# EAGLE schematic IRQF103C8 (EAGLE 7.6.0)
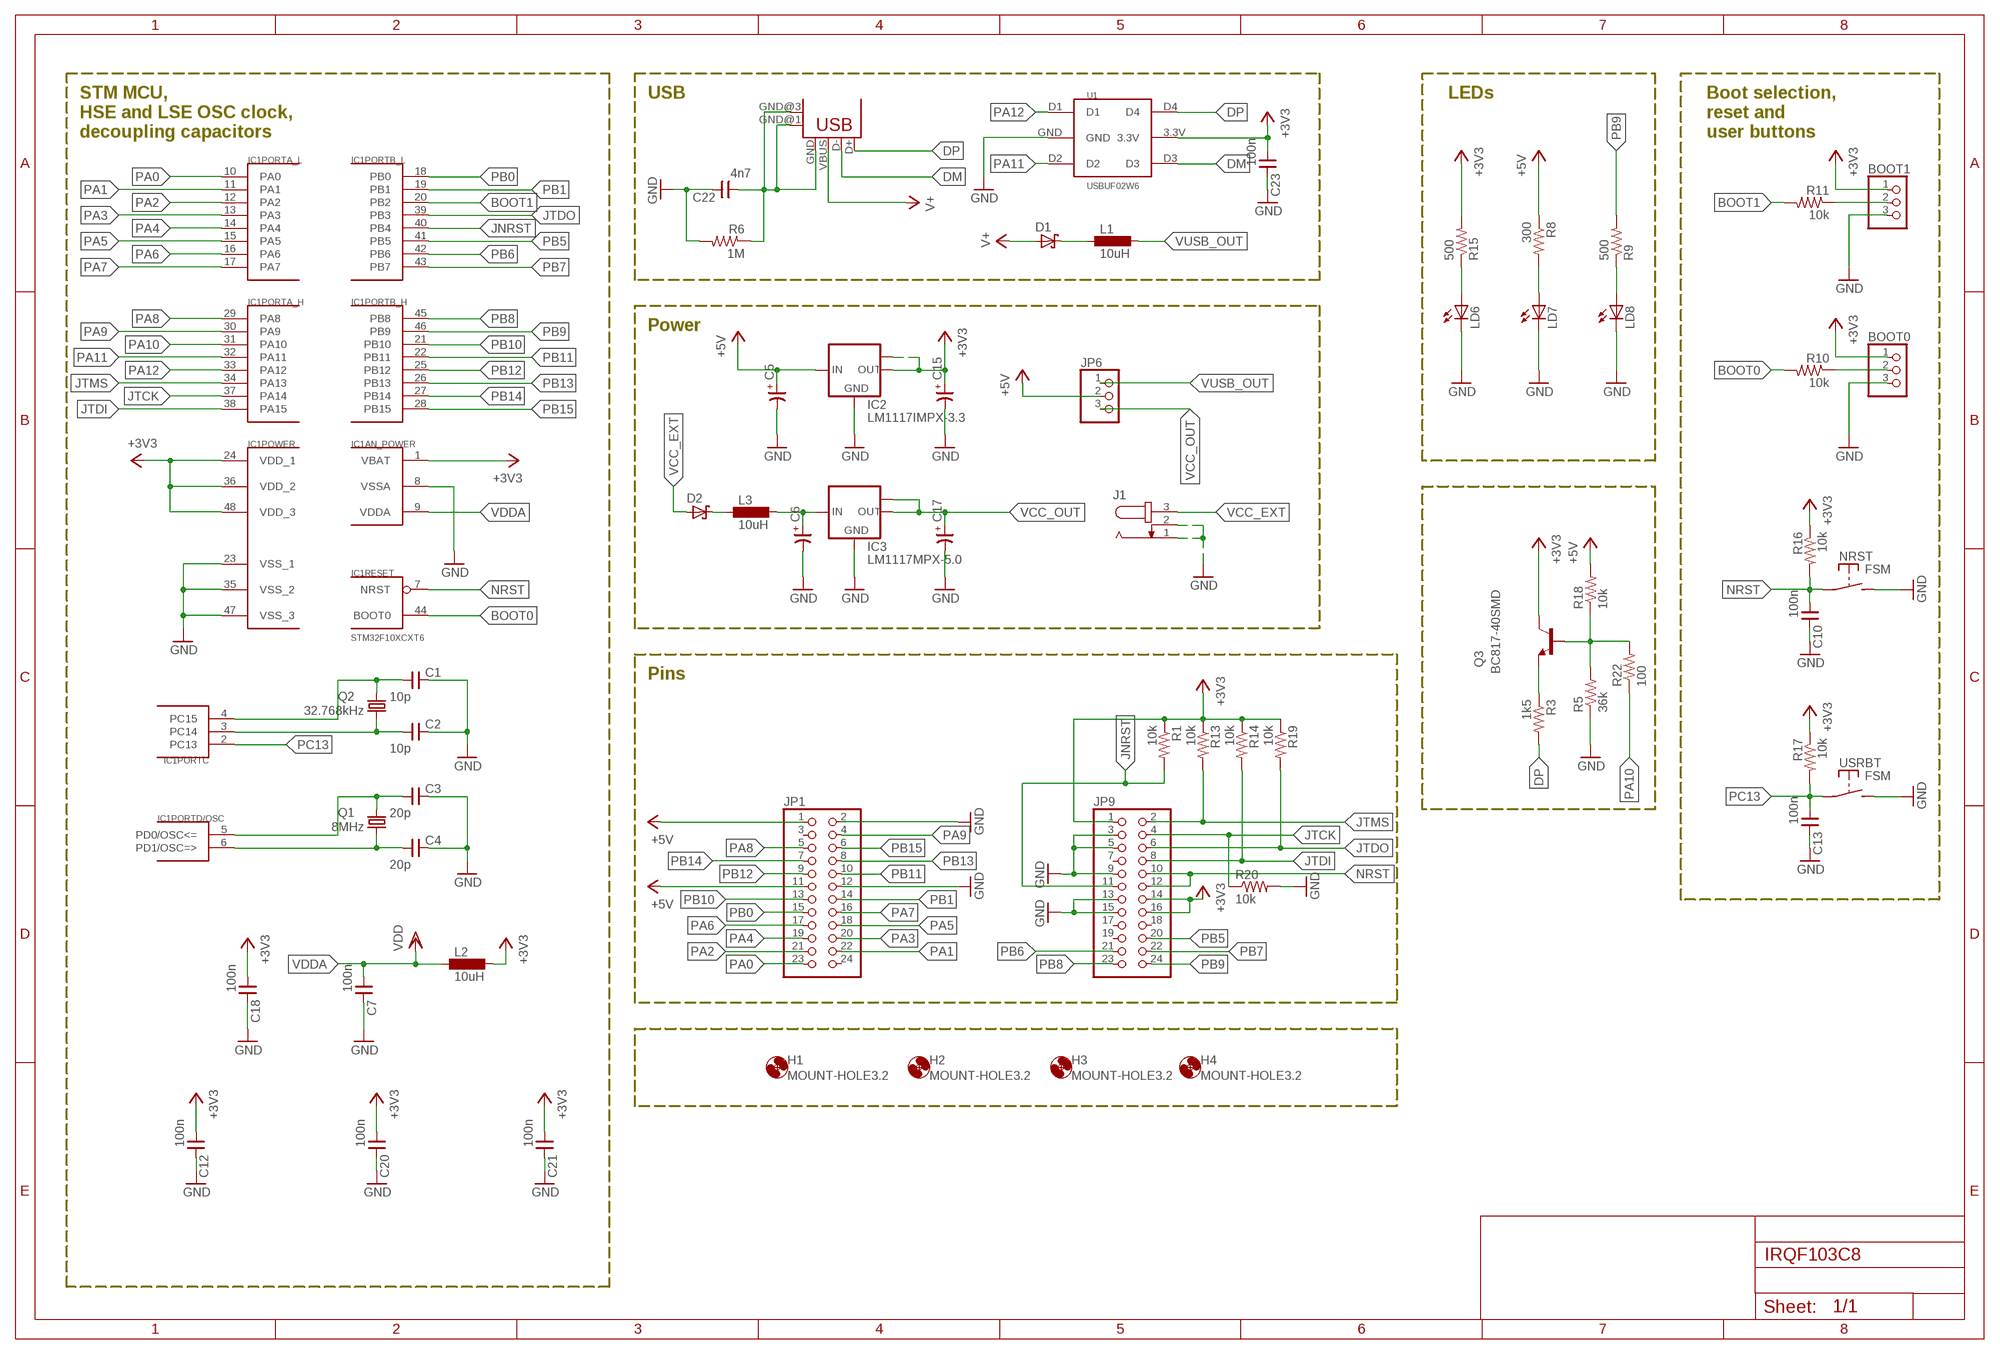
[diagram p0: schematic, sheet 1]

## Parts
BOOT0  PINHD-1X3  [1X03]
BOOT1  PINHD-1X3  [1X03]
C1  10p  CNP-0805  [0805]
C2  10p  CNP-0805  [0805]
C3  20p  CNP-0805  [0805]
C4  20p  CNP-0805  [0805]
C5  CP-3258-TE-B  [3528-TE-B]
C6  CP-3258-TE-B  [3528-TE-B]
C7  100n  CNP-0805  [0805]
C10  100n  CNP-0805  [0805]
C12  100n  CNP-0805  [0805]
C13  100n  CNP-0805  [0805]
C15  CP-3216-TE-A  [3216-TE-A]
C17  CP-3216-TE-A  [3216-TE-A]
C18  100n  CNP-0805  [0805]
C20  100n  CNP-0805  [0805]
C21  100n  CNP-0805  [0805]
C22  4n7  CNP-0805  [0805]
C23  100n  CNP-0805  [0805]
D1  SCHOTTKY_SMA  [DIOM5326X292N]
D2  SCHOTTKY_SMA  [DIOM5326X292N]
H1  MOUNT-HOLE3.2  [3,2]
H2  MOUNT-HOLE3.2  [3,2]
H3  MOUNT-HOLE3.2  [3,2]
H4  MOUNT-HOLE3.2  [3,2]
IC1  STM32F10XCXT6  [TQFP48]
IC2  LM1117IMPX-3.3  [SOT223]
IC3  LM1117MPX-5.0  [SOT223]
J1  JACK-PLUG1  [SPC4078]
JP1  PINHD-2X12  [2X12]
JP6  PINHD-1X3  [1X03]
JP9  PINHD-2X12  [2X12]
L1  10uH  INDUCTOR_0603  [INDC1608X95N]
L2  10uH  INDUCTOR_0603  [INDC1608X95N]
L3  10uH  INDUCTOR_0603  [INDC1608X95N]
LD6  LEDCHIPLED_0805  [CHIPLED_0805]
LD7  LEDCHIPLED_0805  [CHIPLED_0805]
LD8  LEDCHIPLED_0805  [CHIPLED_0805]
NRST  FSM  [FSM]
Q1  8MHz  CRYTALHC49S  [HC49/S]
Q2  32.768kHz  CRYTALTC26H  [TC26H]
Q3  BC817-40SMD  [SOT23-BEC]
R1  10k  R-US_M0805  [M0805]
R3  1k5  R-US_M0805  [M0805]
R5  36k  R-US_M0805  [M0805]
R6  1M  R-US_M0805  [M0805]
R8  300  R-US_M0805  [M0805]
R9  500  R-US_M0805  [M0805]
R10  10k  R-US_M0805  [M0805]
R11  10k  R-US_M0805  [M0805]
R13  10k  R-US_M0805  [M0805]
R14  10k  R-US_M0805  [M0805]
R15  500  R-US_M0805  [M0805]
R16  10k  R-US_M0805  [M0805]
R17  10k  R-US_M0805  [M0805]
R18  10k  R-US_M0805  [M0805]
R19  10k  R-US_M0805  [M0805]
R20  10k  R-US_M0805  [M0805]
R22  100  R-US_M0805  [M0805]
U1  USBUF02W6  [SOT23-6L]
USB1  USB-MB-S  [USB-MB-S]
USRBT  FSM  [FSM]

## Nets
+3V3: BOOT0.1 BOOT1.1 C12.1 C15.+ C18.1 C20.1 C21.1 C23.1 IC1.1(AN_POWER:VBAT) IC1.24(POWER:VDD_1) IC1.36(POWER:VDD_2) IC1.48(POWER:VDD_3) IC2.2(OUT) IC2.TAB(OUT1) JP9.1 JP9.14 JP9.16 L2.2 Q3.C R1.1 R13.1 R14.1 R15.2 R16.1 R17.1 R19.1 U1.3.3V
+5V: C5.+ IC2.3(IN) JP1.1 JP1.11 JP6.2 R8.1 R18.2
BOOT0: IC1.44(RESET:BOOT0) R10.2
BOOT1: IC1.20(PORTB_L:PB2) R11.2
DM: U1.D3 USB1.D-
DP: R3.2 U1.D4 USB1.D+
GND: BOOT0.3 BOOT1.3 C1.2 C2.2 C3.2 C4.2 C5.- C6.- C7.2 C10.2 C12.2 C13.2 C15.- C17.- C18.2 C20.2 C21.2 C22.2 C23.2 IC1.8(AN_POWER:VSSA) IC1.23(POWER:VSS_1) IC1.35(POWER:VSS_2) IC1.47(POWER:VSS_3) IC2.1(GND) IC3.1(GND) J1.1 J1.2 JP1.2 JP1.12 JP9.3 JP9.5 JP9.9 JP9.13 JP9.15 LD6.C LD7.C LD8.C NRST.P$2(S) R5.1 R6.2 R20.2 U1.GND USRBT.P$2(S)
JNRST: IC1.40(PORTB_L:PB4) JP9.11 R1.2
JTCK: IC1.37(PORTA_H:PA14) JP9.4 R20.1
JTDI: IC1.38(PORTA_H:PA15) JP9.8 R14.2
JTDO: IC1.39(PORTB_L:PB3) JP9.6 R19.2
JTMS: IC1.34(PORTA_H:PA13) JP9.2 R13.2
N$1: C2.1 IC1.3(PORTC:PC14) Q2.1
N$2: C1.1 IC1.4(PORTC:PC15) Q2.2
N$3: C4.1 IC1.6(PORTD/OSC:PD1/OSC=>) Q1.1
N$4: C3.1 IC1.5(PORTD/OSC:PD0/OSC<=) Q1.2
N$5: BOOT0.2 R10.1
N$6: LD7.A R8.2
N$7: D2.K L3.1
N$8: D1.K L1.1
N$9: Q3.B R5.2 R18.1 R22.2
N$10: C6.+ IC3.3(IN) L3.2
N$11: Q3.E R3.1
N$15: LD8.A R9.1
N$16: C22.1 R6.1 USB1.GND USB1.GND@1(GND) USB1.GND@3(GND)
N$19: LD6.A R15.1
NRST: C10.1 IC1.7(RESET:NRST) JP9.10 JP9.12 NRST.P$1(P) R16.2
PA0: IC1.10(PORTA_L:PA0) JP1.23
PA1: IC1.11(PORTA_L:PA1) JP1.22
PA2: IC1.12(PORTA_L:PA2) JP1.21
PA3: IC1.13(PORTA_L:PA3) JP1.20
PA4: IC1.14(PORTA_L:PA4) JP1.19
PA5: IC1.15(PORTA_L:PA5) JP1.18
PA6: IC1.16(PORTA_L:PA6) JP1.17
PA7: IC1.17(PORTA_L:PA7) JP1.16
PA8: IC1.29(PORTA_H:PA8) JP1.5
PA9: IC1.30(PORTA_H:PA9) JP1.4
PA10: IC1.31(PORTA_H:PA10) R22.1
PA11: IC1.32(PORTA_H:PA11) U1.D2
PA12: IC1.33(PORTA_H:PA12) U1.D1
PB0: IC1.18(PORTB_L:PB0) JP1.15
PB1: IC1.19(PORTB_L:PB1) JP1.14
PB2: BOOT1.2 R11.1
PB5: IC1.41(PORTB_L:PB5) JP9.20
PB6: IC1.42(PORTB_L:PB6) JP9.21
PB7: IC1.43(PORTB_L:PB7) JP9.22
PB8: IC1.45(PORTB_H:PB8) JP9.23
PB9: IC1.46(PORTB_H:PB9) JP9.24 R9.2
PB10: IC1.21(PORTB_H:PB10) JP1.13
PB11: IC1.22(PORTB_H:PB11) JP1.10
PB12: IC1.25(PORTB_H:PB12) JP1.9
PB13: IC1.26(PORTB_H:PB13) JP1.8
PB14: IC1.27(PORTB_H:PB14) JP1.7
PB15: IC1.28(PORTB_H:PB15) JP1.6
PC13: C13.1 IC1.2(PORTC:PC13) R17.2 USRBT.P$1(P)
V+: D1.A USB1.VBUS
VCC_EXT: D2.A J1.3
VCC_OUT: C17.+ IC3.2(OUT) IC3.TAB(OUT1) JP6.3
VDDA: C7.1 IC1.9(AN_POWER:VDDA) L2.1 ; supply symbol labelled VDD
VUSB_OUT: JP6.1 L1.2
Unconnected: JP1.3 JP1.24 JP9.7 JP9.17 JP9.18 JP9.19

## Notes on the sheet
- USB | LEDs
- STM MCU, 
  HSE and LSE OSC clock,
  decoupling capacitors
- Boot selection,
  reset and
  user buttons
- Power
- Pins

## Library data of the parts
BOOT0 BOOT1 JP6 = pinhead:PINHD-1X3: PIN HEADER
C1-C4 C7 C10 C12 C13 C18 C20-C23 = cap-master:CNP-: NON-POLARIZED CAP
C5 C6 C15 C17 = cap-master:CP-: POLARIZED CAP
D1 D2 = ipc-7351-diode:SCHOTTKY_
H1-H4 = holes:MOUNT-HOLE: MOUNTING HOLE with drill center marker
IC1 = stm32:STM32F10XCXT6: ST STM32F101/103 48pin LQFP
IC2 = lm1117:LM1117IMPX-*
IC3 = lm1117:LM1117MPX-*
J1 = con-jack:JACK-PLUG: DC POWER JACK Power Jack, DC, Right Angle, Through Hole, Rated 5A at 16VDC, PC Terminals Distributor: Farnell (www.Farnell.de) Drawing: 84N1161.pdf / 84N1162.pdf Manufacturer: SPC Technology (www.spctechnology.com) Type: SPC4077 / SPC 4078
JP1 JP9 = pinhead:PINHD-2X12: PIN HEADER
L1-L3 = ipc-7351-inductor:INDUCTOR_
LD6-LD8 = led:LED: LED OSRAM: - CHIPLED LG R971, LG N971, LY N971, LG Q971, LY Q971, LO R971, LY R971 LH N974, LH R974 LS Q976, LO Q976, LY Q976 LO Q996 - Hyper CHIPLED LW Q18S LB Q993, LB Q99A, LB R99A - SideLED LS A670, LO A670, LY A670, LG A670, LP A670 LB A673, LV A673, LT A673, LW A673 LH A674 LY A675 LS A676, LA A676, LO A676, LY A676, LW A676 LS A679, LY A679, LG A679 - Hyper Micro SIDELED® LS Y876, LA Y876, LO Y876, LY Y876 LT Y87S - SmartLED LW L88C, LW L88S LB L89C, LB L89S, LG L890 LS L89K, LO L89K, LY L89K LS L896, LA L896, LO L896, LY L896 - TOPLED LS T670, LO T670, LY T670, LG T670, LP T670 LSG T670, LSP T670, LSY T670, LOP T670, LYG T670 LG T671, LOG T671, LSG T671 LB T673, LV T673, LT T673, LW T673 LH T674 LS T676, LA T676, LO T676, LY T676, LB T676, LH T676, LSB T676, LW T676 LB T67C, LV T67C, LT T67C, LS T67K, LO T67K, LY T67K, LW E67C LS E67B, LA E67B, LO E67B, LY E67B, LB E67C, LV E67C, LT E67C LW T67C LS T679, LY T679, LG T679 LS T770, LO T770, LY T770, LG T770, LP T770 LB T773, LV T773, LT T773, LW T773 LH T774 LS E675, LA E675, LY E675, LS T675 LS T776, LA T776, LO T776, LY T776, LB T776 LHGB T686 LT T68C, LB T68C - Hyper Mini TOPLED® LB M676 - Mini TOPLED Santana® LG M470 LS M47K, LO M47K, LY M47K Source: http://www.osram.convergy.de/
NRST USRBT = switch-misc:FSM: TYCO SWITCH
Q1 Q2 = crystal:CRYTAL: CRYSTAL
Q3 = transistor-npn:BC817*: NPN Transistor
R1 R3 R5 R6 R8-R11 R13-R20 R22 = resistor:R-US_: RESISTOR, American symbol
U1 = USBUF:USBUF02W6: EMI filter and line termination for USB upstream ports
USB1 = con-usb-2:USB: USB Connectors